# EAGLE design Torch-Led board (EAGLE 8.3.0)
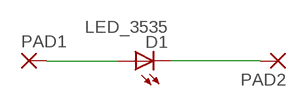
[diagram p0: schematic, sheet 1]

## Parts
D1  LED_3535  [LED3535]
PAD1  2,15/1,0  [2,15/1,0]
PAD2  2,15/1,0  [2,15/1,0]

## Nets
N$1: D1.P$1(A) PAD1.1(P)
N$2: D1.P$3(C) PAD2.1(P)

## Library data of the parts
D1 = Namenlos:LED_
PAD1 PAD2 = wirepad:2,15/1,0: THROUGH-HOLE PAD

## Board
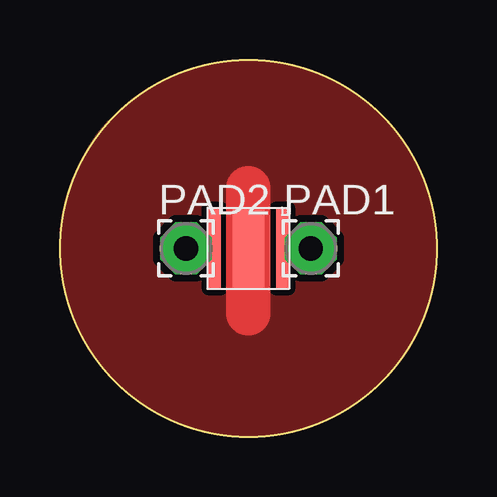
[diagram p1: board, top side]

Size 15.7 x 15.7 mm. Coordinates in mm from the lower left corner, seen from the top.
Outline: circle at 7.85,7.85 radius 7.85
Copper layers (1*16): Top 0.035mm / dielectric 1.5mm / Bottom 0.035mm
Design rules "default *": minimum track width 6mil, minimum drill 0.35mm, track to track 6mil, track to pad 6mil, pad to pad 6mil, via to via 6mil, smd to smd 6mil, copper to edge 0mil, drill to drill 6mil, minimum pad ring 10mil, minimum via ring 8mil, stop-mask expansion 4mil, vias tented up to drill 0mil, thermal gap 10mil

### Footprints (pad centres in the part's own frame; a part is rotated, then mirrored left to right if it is on the bottom)
LED3535 = smd 0.5 x 3.3: P$1 1.4,0; P$3 -1.4,0 | smd 1.3 x 3.3: P$2 0,0
2,15/1,0 = drill 1.016 pad 2.159 octagon: 1 0,0

### Placement (x,y rotation side)
D1  7.85,7.85 0 top
PAD1  10.45,7.85 0 top
PAD2  5.25,7.85 0 top

### Tracks (layer width: path | path; a pad name or v marks a point on that pad's centre or on a via)
N$1
  Top 0.152: D1.P$1 PAD1.1
N$2
  Top 0.152: D1.P$3 PAD2.1
P$2
  Top 1.85: 7.85,10.35 7.85,5.15
  pour Top (isolate 0.305, no thermals): 0,7.85 0,7.9 arc-90 7.8,15.7 7.85,15.7 arc-90 15.7,7.85 15.7,7.8 arc-90 7.9,0 7.85,0 arc-90